# EAGLE design ENC15LED (EAGLE 7.1.0)
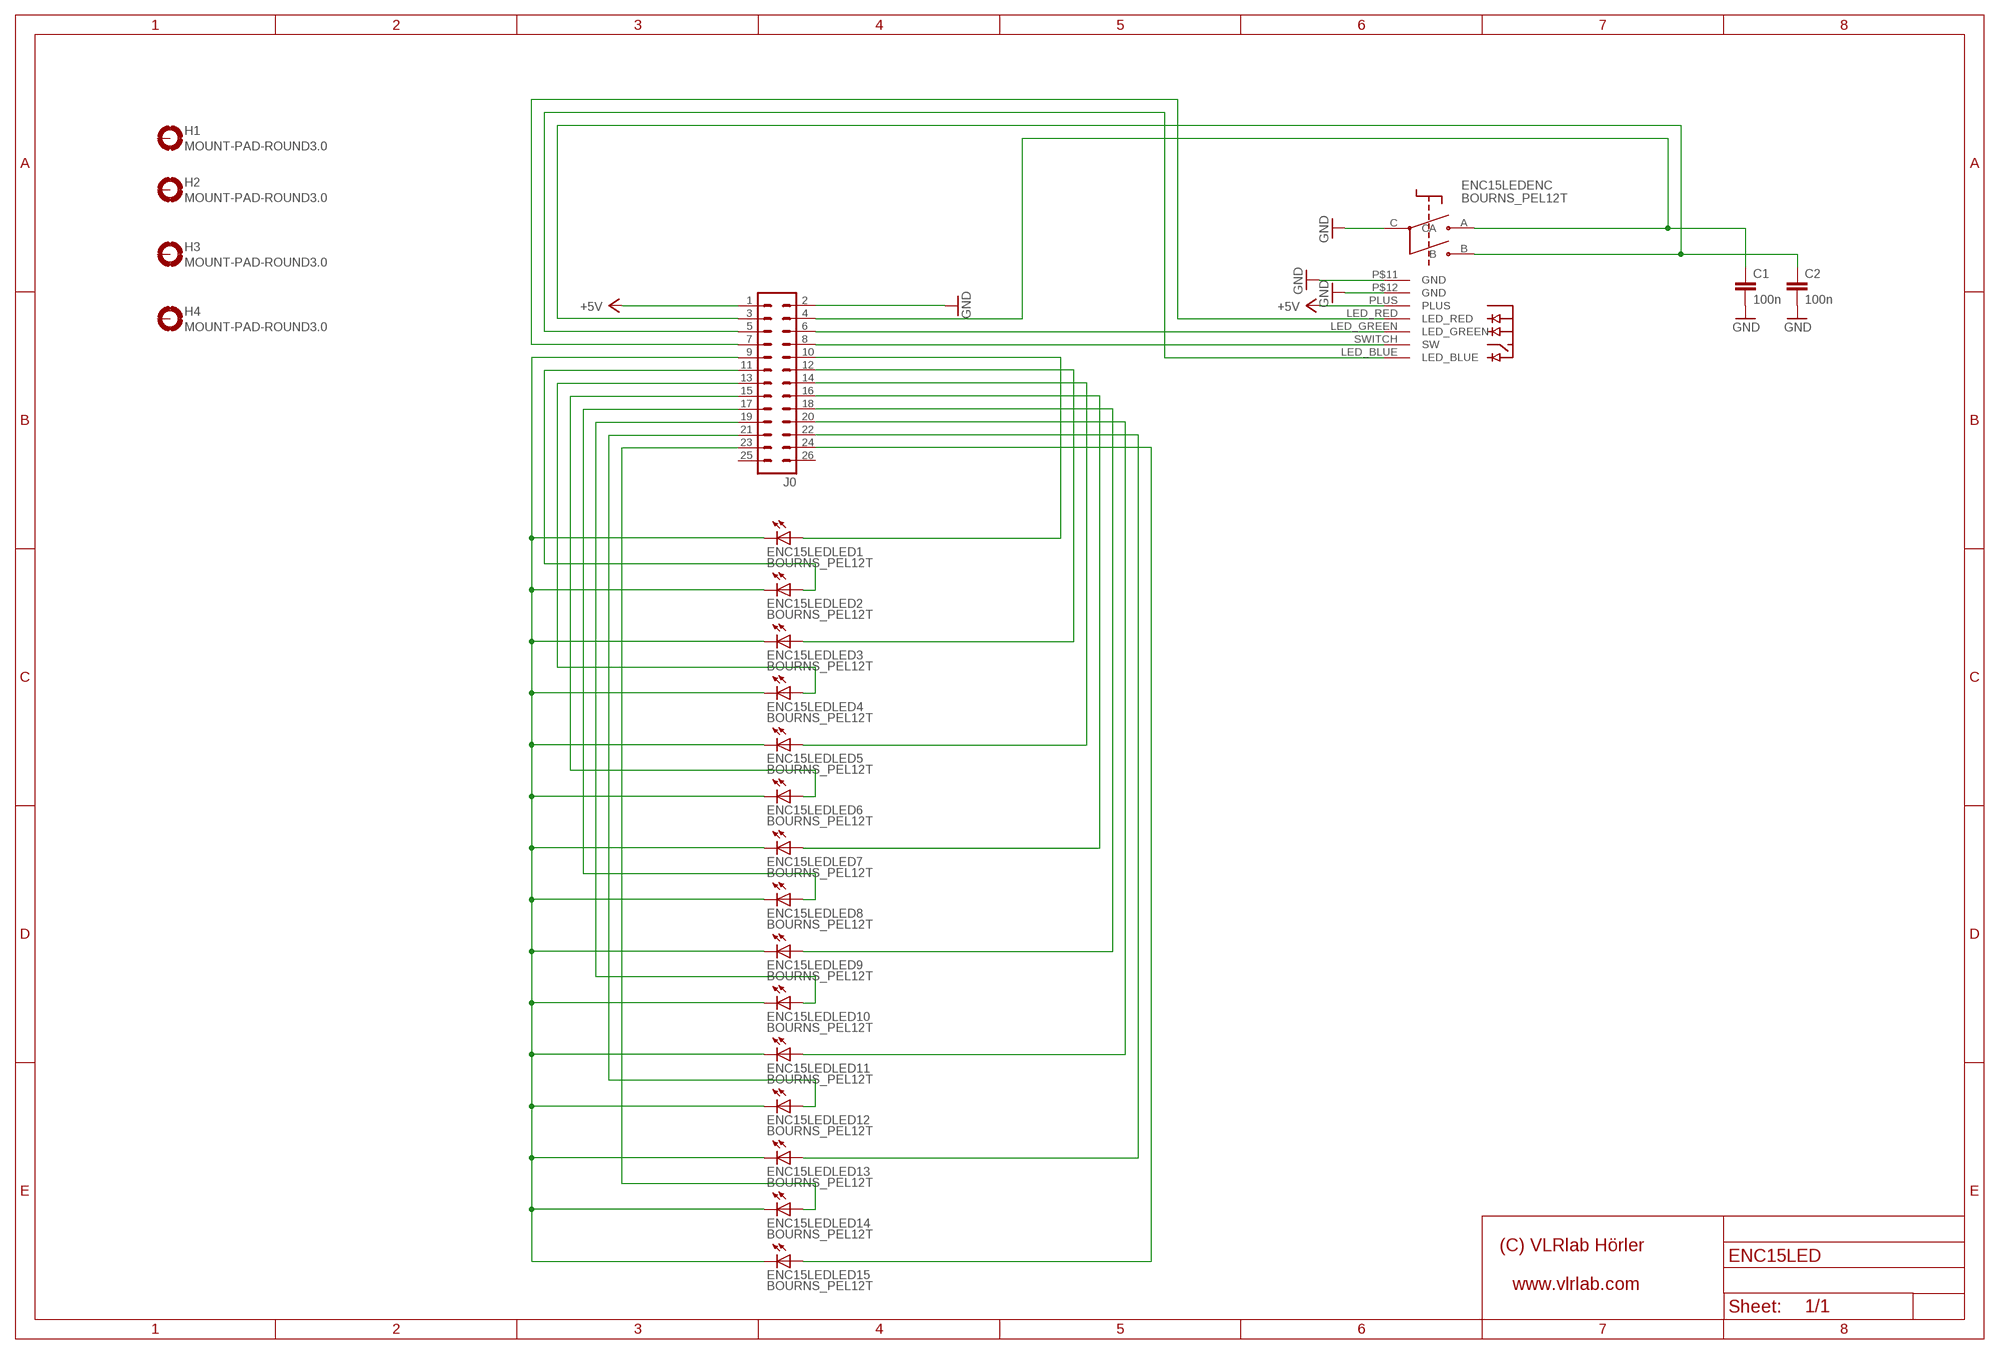
[diagram p0: schematic, sheet 1]

## Parts
C1  100n  C-EU025-025X050  [C025-025X050]
C2  100n  C-EU025-025X050  [C025-025X050]
ENC15LED  BOURNS_PEL12T  BOURNS_PEL12T_LED-RING  [PEL12T_15LED-RING]
H1  MOUNT-PAD-ROUND3.0  [3,0-PAD]
H2  MOUNT-PAD-ROUND3.0  [3,0-PAD]
H3  MOUNT-PAD-ROUND3.0  [3,0-PAD]
H4  MOUNT-PAD-ROUND3.0  [3,0-PAD]
J0  ML26  [ML26]

## Nets
+5V [VDD]: ENC15LED.PLUS(ENC:PLUS) J0.1
BLUE: ENC15LED.LED_BLUE(ENC:LED_BLUE) J0.5
GND: C1.2 C2.2 ENC15LED.C(ENC:C) ENC15LED.P$11(ENC:GND) ENC15LED.P$12(ENC:GND) J0.2
GREEN: ENC15LED.LED_GREEN(ENC:LED_GREEN) J0.6
N$1: ENC15LED.A01(LED1:A) J0.10
N$2: ENC15LED.A02(LED2:A) J0.11
N$3: ENC15LED.A03(LED3:A) J0.12
N$4: ENC15LED.A04(LED4:A) J0.13
N$5: ENC15LED.A05(LED5:A) J0.14
N$6: ENC15LED.A06(LED6:A) J0.15
N$7 [VDD]: ENC15LED.K01(LED1:C) ENC15LED.K02(LED2:C) ENC15LED.K03(LED3:C) ENC15LED.K04(LED4:C) ENC15LED.K05(LED5:C) ENC15LED.K06(LED6:C) ENC15LED.K07(LED7:C) ENC15LED.K08(LED8:C) ENC15LED.K09(LED9:C) ENC15LED.K10(LED10:C) ENC15LED.K11(LED11:C) ENC15LED.K12(LED12:C) ENC15LED.K13(LED13:C) ENC15LED.K14(LED14:C) ENC15LED.K15(LED15:C) J0.9
N$8: ENC15LED.A07(LED7:A) J0.16
N$9: ENC15LED.A08(LED8:A) J0.17
N$10: ENC15LED.A09(LED9:A) J0.18
N$11: ENC15LED.A10(LED10:A) J0.19
N$12: ENC15LED.A11(LED11:A) J0.20
N$13: ENC15LED.A12(LED12:A) J0.21
N$14: ENC15LED.A13(LED13:A) J0.22
N$15: ENC15LED.A14(LED14:A) J0.23
N$16: ENC15LED.A15(LED15:A) J0.24
PIN_A: C1.1 ENC15LED.A(ENC:A) J0.4
PIN_B: C2.1 ENC15LED.B(ENC:B) J0.3
RED: ENC15LED.LED_RED(ENC:LED_RED) J0.7
SWITCH: ENC15LED.SWITCH(ENC:SW) J0.8
Unconnected: H1.B3,0(MOUNT) H2.B3,0(MOUNT) H3.B3,0(MOUNT) H4.B3,0(MOUNT) J0.25 J0.26

## Library data of the parts
C1 C2 = rcl:C-EU: CAPACITOR, European symbol
ENC15LED = Bourns Encoder:BOURNS_PEL12T_LED-RING
H1-H4 = holes:MOUNT-PAD-ROUND: MOUNTING PAD, round
J0 = con-ml_Ivan:ML26: HARTING; OC_FARNELL: unknown; OC_NEWARK: unknown

## Net classes
0 default: width 0.254 mm, drill 0.33 mm, clearance 0.254 mm
1 VDD: width 0.813 mm, drill 0.33 mm, clearance 0.254 mm to class 0, clearance 0.254 mm
2 10V: width 1.016 mm, drill 0.33 mm, clearance 0.254 mm to class 0, clearance 0.254 mm to class 1, clearance 0.254 mm

## Board
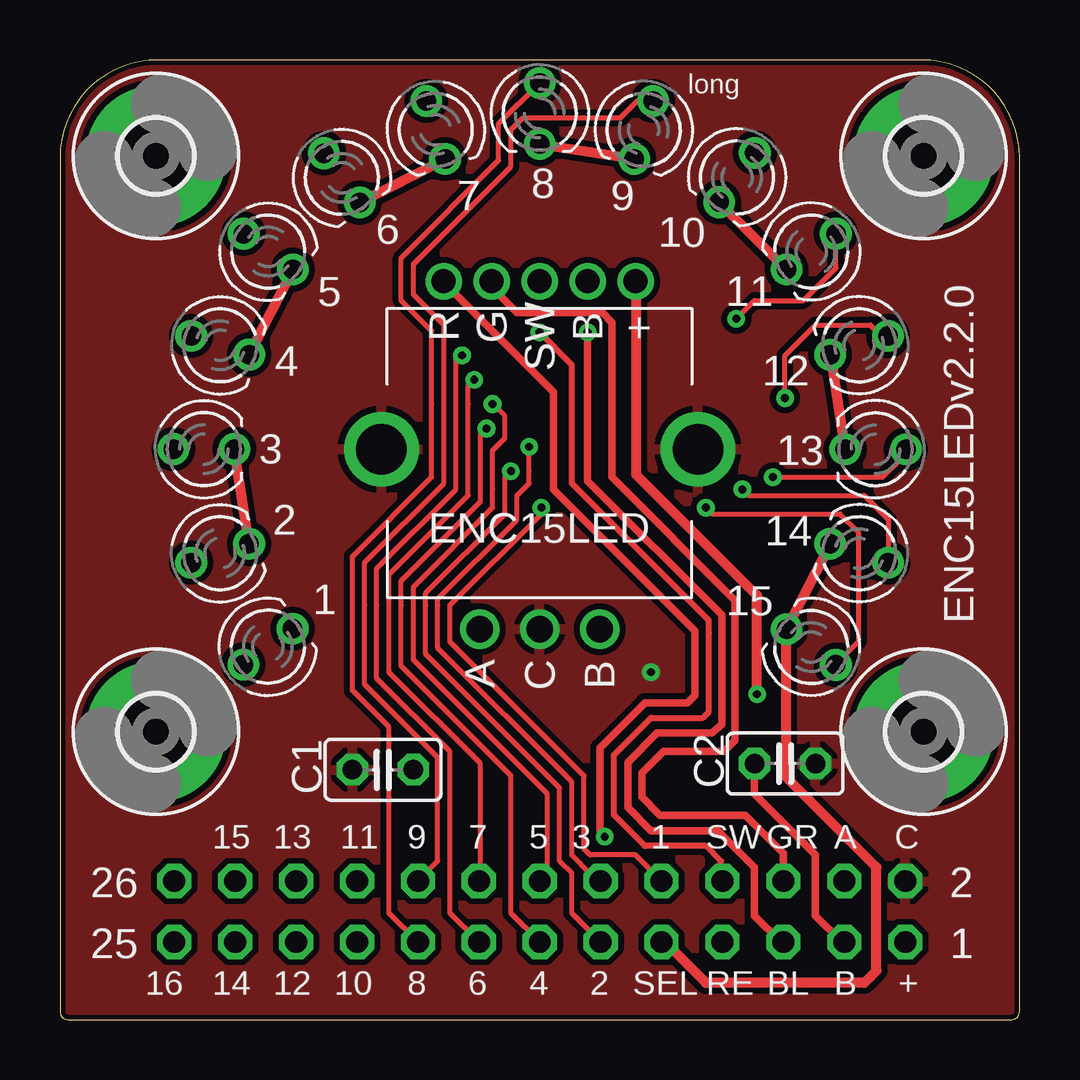
[diagram p1: board, top side]
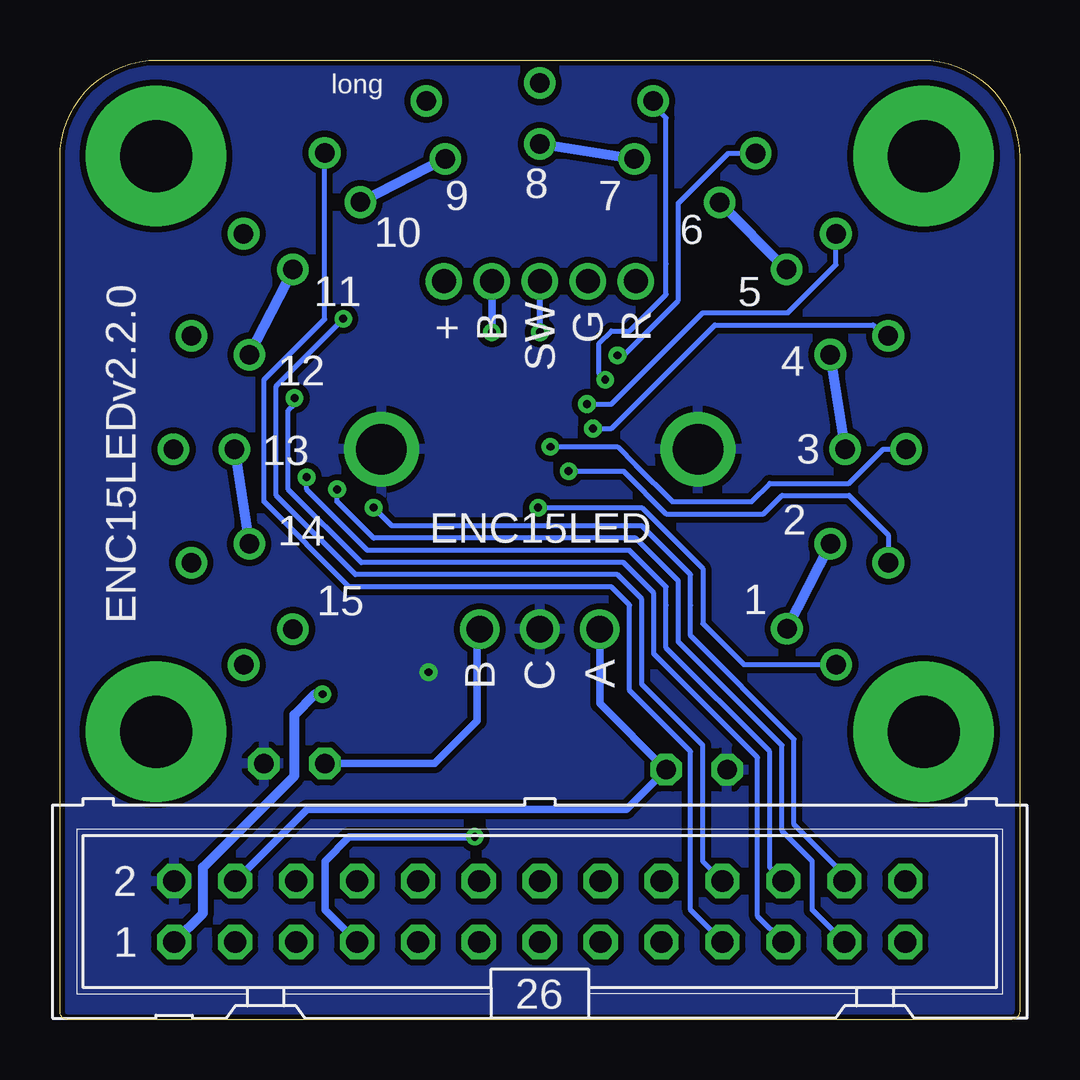
[diagram p2: board, bottom side, seen from below]

Size 40 x 40 mm. Coordinates in mm from the lower left corner, seen from the top.
Outline: 0,35.94 0,0.32 arc90 0.32,0 39.68,0 arc90 40,0.32 40,35.94 arc90 35.94,40 4.06,40 arc90 0,35.94
Copper layers (1*16): Top 0.035mm / dielectric 1.5mm / Bottom 0.035mm
Design rules "default *": minimum track width 10mil, minimum drill 24mil, track to track 8mil, track to pad 8mil, pad to pad 8mil, via to via 8mil, smd to smd 8mil, copper to edge 8mil, drill to drill 8mil, minimum pad ring 10mil, minimum via ring 8mil, stop-mask expansion 4mil, vias tented up to drill 0mil, thermal gap 10mil

### Footprints (pad centres in the part's own frame; a part is rotated, then mirrored left to right if it is on the bottom)
C025-025X050 = drill 0.813 octagon: 1 -1.27,0; 2 1.27,0
PEL12T_15LED-RING = drill 1.1: A -2.503,-7.475; B 2.497,-7.475; C -0.003,-7.475 | drill 0.813: A01 -12.359,-8.95; A02 -14.531,-4.7; A03 -15.27,0.032; A04 -14.528,4.754; A05 -12.346,9.014; A06 -8.998,12.368; A07 -4.731,14.544; A08 -0.002,15.291; A09 4.724,14.548; A10 8.968,12.384; A11 12.345,9.012; A12 14.52,4.751; A13 15.267,0.025; A14 14.524,-4.703; A15 12.343,-8.964; K01 -10.305,-7.457; K02 -12.116,-3.915; K03 -12.73,0.032; K04 -12.112,3.969; K05 -10.291,7.521; K06 -7.505,10.314; K07 -3.946,12.129; K08 -0.002,12.751; K09 3.939,12.132; K10 7.475,10.329; K11 10.291,7.52; K12 12.105,3.966; K13 12.727,0.025; K14 12.108,-3.918; K15 10.288,-7.471 | drill 1: LED_BLUE 1.997,7.025; LED_GREEN -2.003,7.025; LED_RED -4.003,7.025; PLUS 3.997,7.025; SWITCH -0.003,7.025 | drill 2.108: P$11 6.597,0.025; P$12 -6.603,0.025
3,0-PAD = drill 3 pad 5.842: B3,0 0,0
ML26 = drill 0.914 octagon: 1 -15.24,-1.27; 2 -15.24,1.27; 3 -12.7,-1.27; 4 -12.7,1.27; 5 -10.16,-1.27; 6 -10.16,1.27; 7 -7.62,-1.27; 8 -7.62,1.27; 9 -5.08,-1.27; 10 -5.08,1.27; 11 -2.54,-1.27; 12 -2.54,1.27; 13 0,-1.27; 14 0,1.27; 15 2.54,-1.27; 16 2.54,1.27; 17 5.08,-1.27; 18 5.08,1.27; 19 7.62,-1.27; 20 7.62,1.27; 21 10.16,-1.27; 22 10.16,1.27; 23 12.7,-1.27; 24 12.7,1.27; 25 15.24,-1.27; 26 15.24,1.27

### Placement (x,y rotation side)
C1  13.46,10.41 180 top
C2  30.23,10.67 0 top
ENC15LED  20,23.75 0 top
H1  36,36 0 top
H2  4,36 0 top
H3  36,12 0 top
H4  4,12 0 top
J0  20,4.5 0 bottom
U$1  [VLRLAB_SMAL]  2.54,17.78 90 top
U$2  [VLRLAB_SMAL]  2.54,29.21 270 bottom

### Tracks (layer width: path | path; a pad name or v marks a point on that pad's centre or on a via)
+5V  (via drill 0.33)
  Top 0.406: v29.06,13.56 29.06,17.68 24.03,22.71 24.03,30.74 ENC15LED.PLUS
  Bottom 0.406: J0.1 34.04,4.43 34.04,6.35 30.23,10.16 30.23,12.7 29.36,13.56 v29.06,13.56
BLUE  (via drill 0.33)
  Top 0.305: J0.5 30.04,3.23 28.96,4.32 28.96,6.35 27.43,7.87 24.64,7.87 23.67,8.84 23.67,10.72 24.89,11.94 27.18,11.94 27.58,12.29 27.58,16.87 22,22.45 v22,28.65
  Bottom 0.305: v22,28.65 22,30.67 ENC15LED.LED_BLUE
GND  (via drill 0.33)
  other vias: 24.64,14.48
  pour Bottom: 40,35.94 40,0.32 arc-90 39.68,0 0.32,0 arc-90 0,0.32 0,35.94 arc-90 4.06,40 35.94,40 arc-90
  pour Top: 40,35.94 40,0.32 arc-90 39.68,0 0.32,0 arc-90 0,0.32 0,35.94 arc-90 4.06,40 35.94,40 arc-90
GREEN
  Top 0.305: J0.6 30.16,6.92 28.57,8.51 25.02,8.51 24.26,9.27 24.26,10.29 25.15,11.18 27.69,11.18 28.14,11.63 28.14,17.48 23.01,22.61 23.01,29.06 22.61,29.46 19.05,29.46 18.03,30.48 18.03,30.99 ENC15LED.LED_GREEN
N$1  (via drill 0.33)
  Top 0.203: J0.10 23.99,6.86 22.1,6.86 21.84,7.11 21.84,10.16 16.26,15.75 16.26,17.27 20.07,21.08 v20.07,21.34
  Bottom 0.203: v20.07,21.34 15.75,21.34 13.21,18.8 13.21,16.51 11.49,14.8 ENC15LED.A01
N$2  (via drill 0.33)
  Top 0.203: J0.11 21.34,4.43 21.34,6.1 20.83,6.6 20.83,9.65 15.24,15.24 15.24,17.27 15.24,17.78 18.54,21.08 18.54,22.61 v18.8,22.86
  Bottom 0.203: v18.8,22.86 16.51,22.86 14.73,21.08 10.67,21.08 9.91,21.84 7.11,21.84 5.47,20.2 ENC15LED.A02
N$3  (via drill 0.33)
  Top 0.203: J0.12 22.21,6.1 22.1,6.1 21.34,6.86 21.34,9.91 15.75,15.49 15.75,17.27 15.75,17.53 19.05,20.83 19.05,21.84 19.3,22.1 19.56,22.35 19.56,22.86 v19.56,23.88
  Bottom 0.203: v19.56,23.88 16.76,23.88 16,23.11 14.48,21.59 11.18,21.59 10.41,22.35 7.11,22.35 5.69,23.78 ENC15LED.A03
N$4  (via drill 0.33)
  Top 0.203: J0.13 18.8,4.43 18.8,10.16 14.22,14.73 14.22,17.27 14.22,18.29 17.53,21.59 17.53,24.38 v17.78,24.64
  Bottom 0.203: v17.78,24.64 17.02,24.64 12.7,28.96 6.1,28.96 5.64,28.5 ENC15LED.A04
N$5  (via drill 0.33)
  Top 0.203: J0.14 20.32,6.09 20.32,9.4 14.73,14.99 14.73,17.27 14.73,18.03 18.03,21.34 18.03,22.1 18.03,23.72 18.54,24.23 18.54,25.15 v18.03,25.65
  Bottom 0.203: v18.03,25.65 17.02,25.65 13.21,29.46 9.65,29.46 7.65,31.46 ENC15LED.A05
N$6  (via drill 0.33)
  Top 0.203: J0.15 16.26,4.43 16.26,11.18 13.21,14.22 13.21,17.27 13.21,18.8 16.51,22.1 16.51,25.65 16.51,27.43 16.51,27.69 v16.76,27.69
  Bottom 0.203: v16.76,27.69 16.51,27.69 14.22,29.97 14.22,33.02 14.22,34.04 12.15,36.11 ENC15LED.A06
N$7
  Top 0.406: ENC15LED.K02 ENC15LED.K03 | ENC15LED.K04 ENC15LED.K05 | ENC15LED.K06 ENC15LED.K07 | ENC15LED.K08 ENC15LED.K09 | ENC15LED.K10 ENC15LED.K11 | ENC15LED.K12 ENC15LED.K13 | ENC15LED.K14 ENC15LED.K15 30.29,10.1 34.04,6.35 34.04,2.03 33.78,1.78 33.53,1.52 26.92,1.52 25.22,3.23 J0.9
  Bottom 0.406: ENC15LED.K01 ENC15LED.K02 | ENC15LED.K03 ENC15LED.K04 | ENC15LED.K05 ENC15LED.K06 | ENC15LED.K07 ENC15LED.K08 | ENC15LED.K09 ENC15LED.K10 | ENC15LED.K11 ENC15LED.K12 | ENC15LED.K13 ENC15LED.K14
N$8  (via drill 0.33)
  Top 0.203: J0.16 17.53,5.84 17.53,10.67 13.72,14.48 13.72,17.27 13.72,18.54 17.02,21.84 17.02,25.65 17.02,26.42 v17.27,26.67
  Bottom 0.203: v17.27,26.67 17.53,26.92 17.53,28.19 17.02,28.7 16.26,28.7 14.73,30.23 14.73,31.5 14.73,37.59 15.27,38.13 ENC15LED.A07
N$9
  Top 0.203: J0.17 13.72,4.43 13.72,12.19 12.19,13.72 12.19,17.27 12.19,19.3 15.49,22.61 15.49,25.65 15.49,28.7 14.22,29.97 14.22,31.75 18.29,35.81 18.29,37.34 19.99,39.04 ENC15LED.A08
N$10
  Top 0.203: J0.18 15.75,6.6 15.75,10.92 12.7,13.97 12.7,17.27 12.7,19.05 16,22.35 16,25.65 16,28.96 14.73,30.23 14.73,31.5 18.8,35.56 18.8,37.08 19.3,37.59 23.37,37.59 24.07,38.29 ENC15LED.A09
N$11
  Bottom 0.203: J0.19 13.72,4.57 13.72,11.18 16.26,13.72 16.26,17.27 17.02,18.03 27.94,18.03 31.5,21.59 31.5,26.67 28.97,29.2 ENC15LED.A10
N$12  (via drill 0.33)
  Top 0.203: v28.19,29.21 28.96,29.97 30.99,29.97 32.34,31.33 ENC15LED.A11
  Bottom 0.203: J0.20 13.21,6.6 13.21,11.43 15.75,13.97 15.75,17.27 15.75,17.53 16.76,18.54 27.69,18.54 30.99,21.84 30.99,26.42 28.45,28.96 v28.19,29.21
N$13  (via drill 0.33)
  Top 0.203: v30.23,25.91 30.23,27.69 31.5,28.96 33.78,28.96 34.24,28.5 ENC15LED.A12
  Bottom 0.203: J0.21 10.92,4.31 10.92,10.92 15.24,15.24 15.24,17.27 15.24,17.78 16.51,19.05 27.43,19.05 30.48,22.1 30.48,25.4 30.23,25.65 v30.23,25.91
N$14  (via drill 0.33)
  Top 0.203: v29.72,22.61 34.29,22.61 35.01,23.33 ENC15LED.A13
  Bottom 0.203: J0.22 10.41,6.34 10.41,11.18 14.73,15.49 14.73,17.27 14.73,18.03 16.26,19.56 27.18,19.56 29.72,22.1 v29.72,22.61
N$15  (via drill 0.33)
  Top 0.203: v28.45,22.1 28.7,21.84 33.53,21.84 34.52,20.85 ENC15LED.A14
  Bottom 0.203: J0.23 8.64,4.57 8.64,6.6 9.91,7.87 9.91,11.43 14.22,15.75 14.22,17.27 14.22,18.29 16,20.07 26.92,20.07 28.45,21.59 v28.45,22.1
N$16  (via drill 0.33)
  Top 0.203: v26.92,21.34 27.18,21.08 32.51,21.08 33.27,20.32 33.27,15.75 32.34,14.82 ENC15LED.A15
  Bottom 0.203: J0.24 7.62,6.09 7.62,6.35 9.4,8.13 9.4,11.68 13.72,16 13.72,17.27 13.72,18.54 15.75,20.57 26.16,20.57 v26.92,21.34
PIN_A
  Bottom 0.305: J0.4 29.71,8.76 19.94,8.76 16.38,8.76 C1.1 17.5,13.18 ENC15LED.A
PIN_B
  Top 0.305: J0.3 32.58,3.23 31.5,4.32 31.5,6.86 29.21,9.14 28.96,9.4 C2.1
  Bottom 0.305: C2.1 24.38,10.67 22.61,12.45 22.61,16.16 ENC15LED.B
RED  (via drill 0.33)
  Top 0.305: v22.71,7.62 22.5,7.87 22.5,11.33 24.38,13.21 26.16,13.21 26.47,13.51 26.47,15.85 26.47,16.2 20.57,22.1 20.57,26.16 16,30.74 ENC15LED.LED_RED
  Bottom 0.305: J0.7 28.96,4.57 28.96,6.6 27.94,7.62 v22.71,7.62
SWITCH  (via drill 0.33)
  Top 0.254: J0.8 27.56,5.83 27.56,6.6 26.92,7.24 24.38,7.24 23.09,8.53 23.09,11.02 24.64,12.57 26.8,12.57 27.05,12.83 27.05,16.1 | 27.05,16.1 27.05,16.13 | 27.05,16.13 27.05,16.1 | v19.99,28.65 21.34,27.28 21.34,22.35 21.51,22.17 27.05,16.64 27.05,16.13 | 27.05,16.1 27.05,16.13
  Bottom 0.254: v19.99,28.65 20,28.85 ENC15LED.SWITCH

### Text on the board
tNames: long | ENC15LEDv2.2.0 | 15 | 13 | 11 | 9 | 7 | 5 | 3 | 1 | SW | GR | A | C | 26 | 2 | 25 | 1 | 16 | 14 | 12 | 10 | 8 | 6 | 4 | 2 | SEL | RE | BL | B | +
bNames: long | ENC15LEDv2.2.0